# Altium schematic sheet [03]-28pins_sch.SchDoc (part 1 of 3)
size A2; DocumentNumber: 3; SheetNumber: 3; SheetTotal: 4
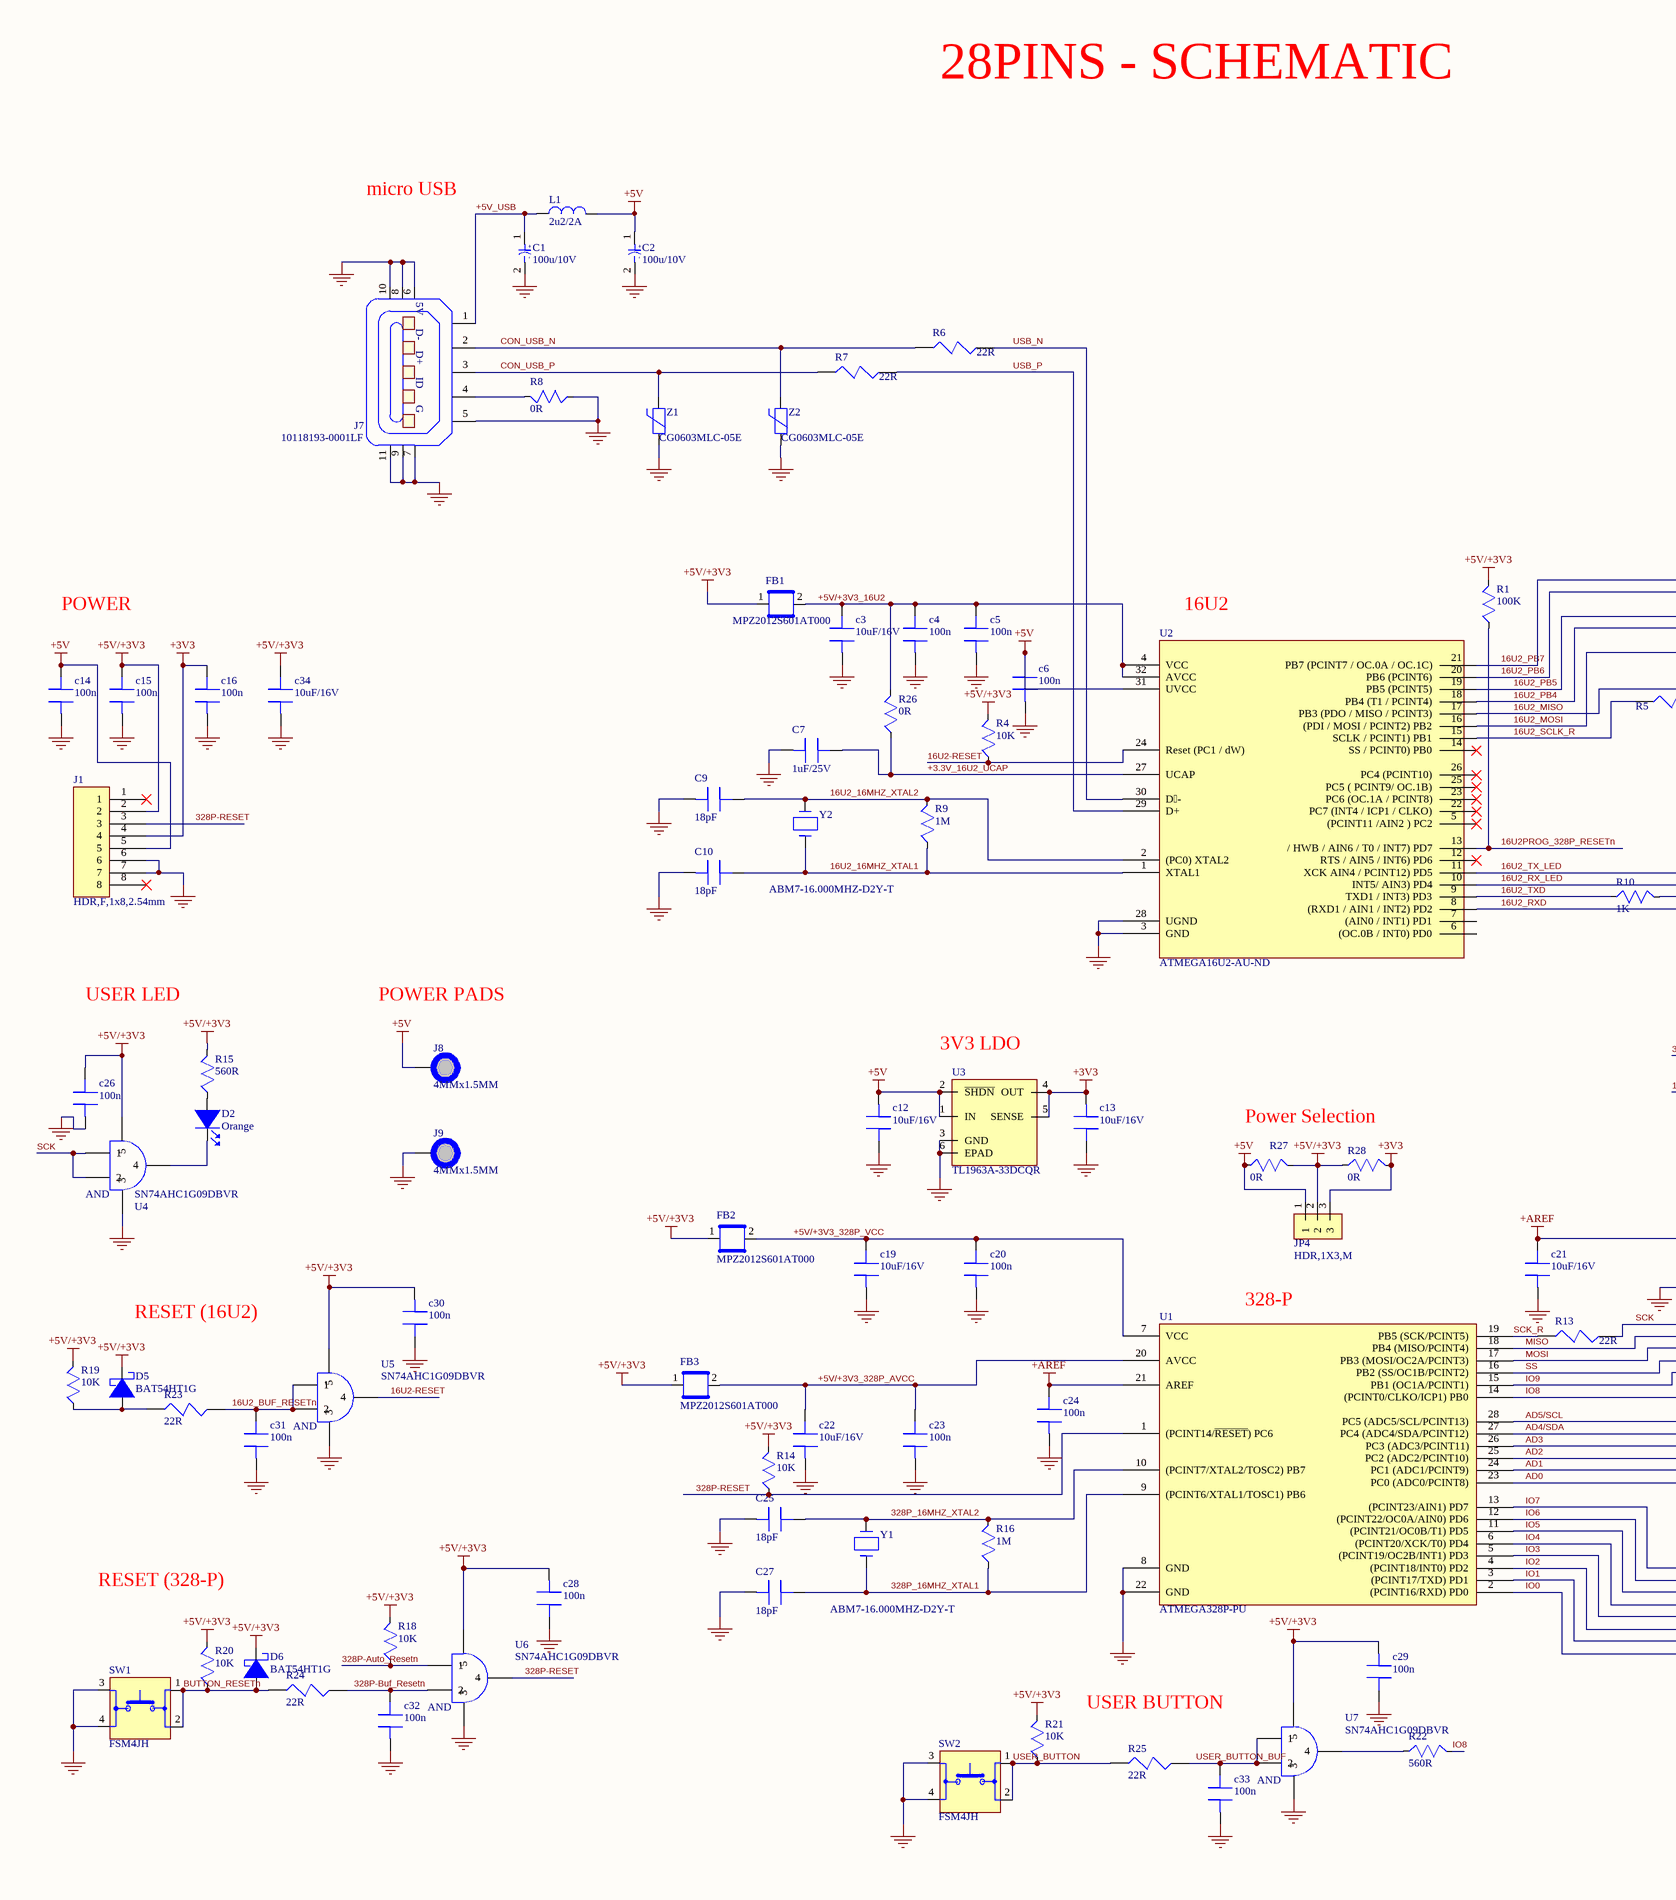
[diagram p0: [03]-28pins_sch.SchDoc, left]
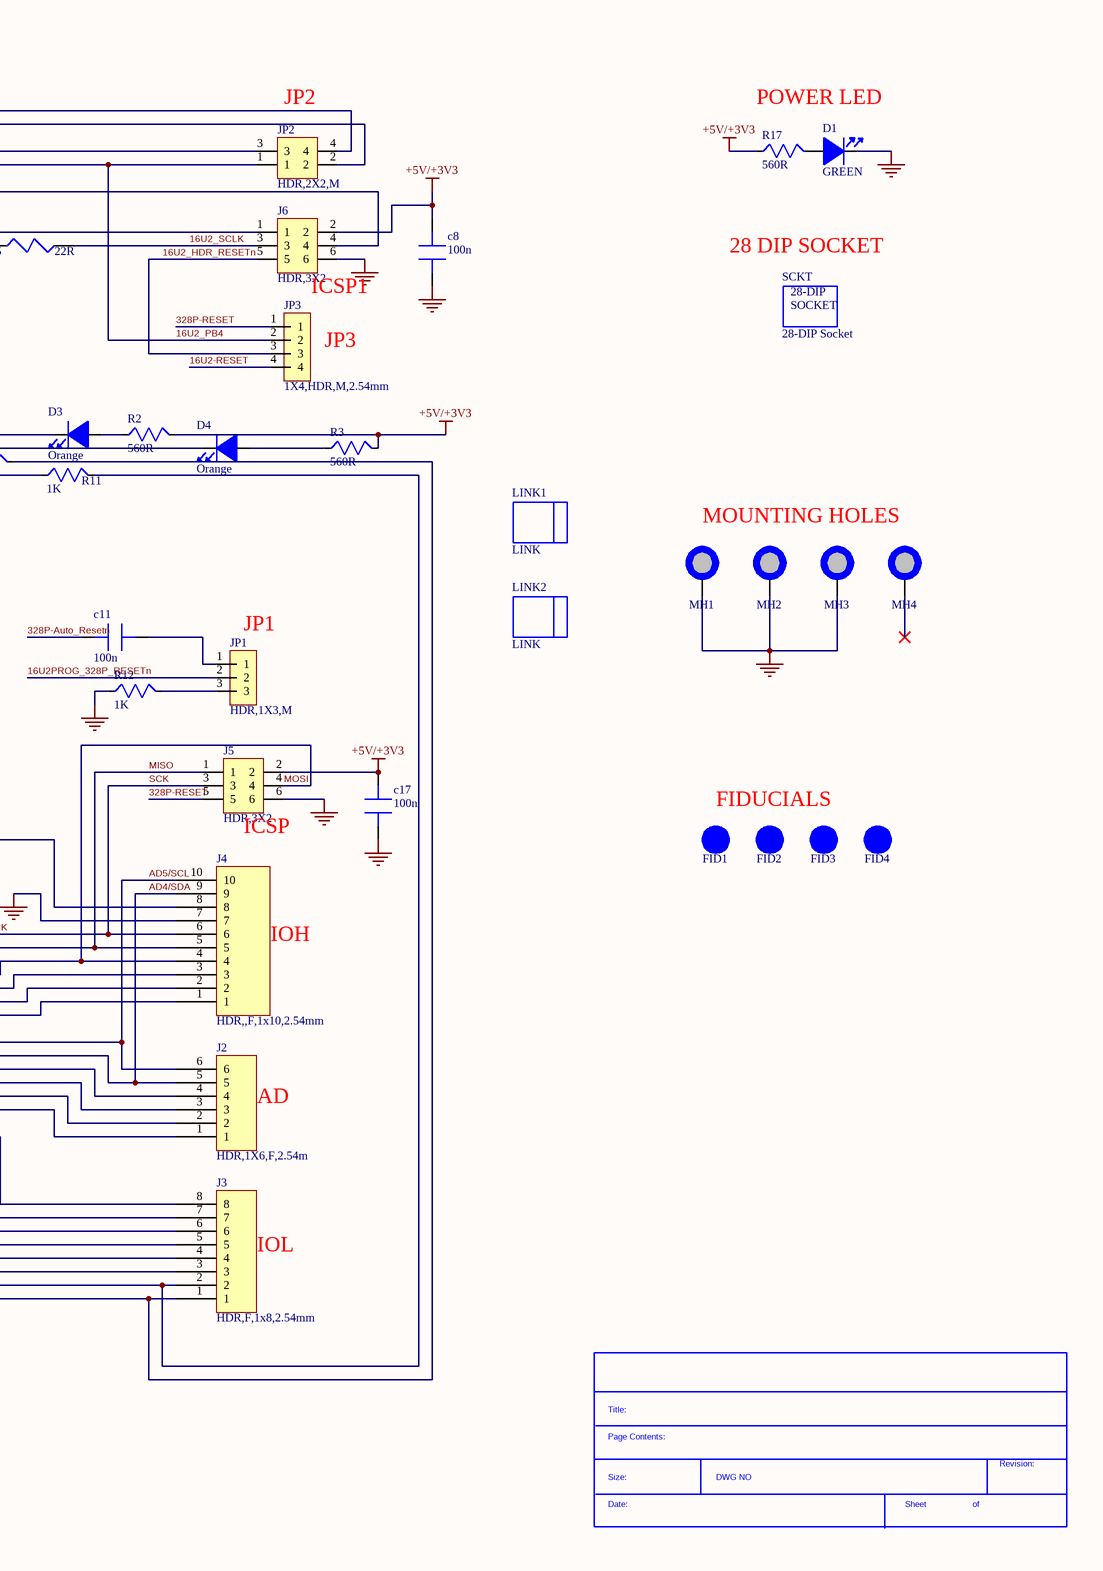
[diagram p1: [03]-28pins_sch.SchDoc, right]

## Parts
*?  SDTitleBlock  (value not drawn)  (graphical)
C1  100u/10V  [C_ALUM]
C2  100u/10V  [C_ALUM]
c3  10uF/16V  [X5R 0805]
c4  100n  [C0805]
c5  100n  [C0805]
c6  100n  [C0805]
C7  1uF/25V  [C0805]
c8  100n  [C0805]
C9  18pF  [C0805]
C10  18pF  [C0805]
c11  100n  [C0805]
c12  10uF/16V  [X5R 0805]
c13  10uF/16V  [X5R 0805]
c14  100n  [C0805]
c15  100n  [C0805]
c16  100n  [C0805]
c17  100n  [C0805]
c19  10uF/16V  [X5R 0805]
c20  100n  [C0805]
c21  10uF/16V  [X5R 0805]
c22  10uF/16V  [X5R 0805]
c23  100n  [C0805]
c24  100n  [C0805]
C25  18pF  [C0805]
c26  100n  [C0805]
C27  18pF  [C0805]
c28  100n  [C0805]
c29  100n  [C0805]
c30  100n  [C0805]
c31  100n  [C0805]
c32  100n  [C0805]
c33  100n  [C0805]
c34  10uF/16V  [X5R 0805]
D1  GREEN  [LED_0603]
D2  Orange  [LED_0603]
D3  Orange  [LED_0603]
D4  Orange  [LED_0603]
D5  BAT54HT1G  [SOD323]
D6  BAT54HT1G  [SOD323]
FB1  MPZ2012S601AT000  [C0805]
FB2  MPZ2012S601AT000  [C0805]
FB3  MPZ2012S601AT000  [C0805]
FID1  1MMC  [FID _40x120D]  (value not drawn)  (no BOM)
FID2  1MMC  [FID _40x120D]  (value not drawn)  (no BOM)
FID3  1MMC  [FID _40x120D]  (value not drawn)  (no BOM)
FID4  1MMC  [FID _40x120D]  (value not drawn)  (no BOM)
J1  HDR,F,1x8,2.54mm  [HDR,F,1X8,2.54mm]
J2  HDR,1X6,F,2.54m  [HDR,1X6,F,2.54mm]
J3  HDR,F,1x8,2.54mm  [HDR,F,1X8,2.54mm]
J4  HDR,,F,1x10,2.54mm  [HDR,F,1x10,2.54mm]
J5  HDR,3X2  [HDR,2X3,2.54mm]
J6  HDR,3X2  [HDR,2X3,2.54mm]
J7  10118193-0001LF  [10118193]
J8  4MMx1.5MM  [pad_with_holes_4MMx1.5MM]  (no BOM)
J9  4MMx1.5MM  [pad_with_holes_4MMx1.5MM]  (no BOM)
JP1  HDR,1X3,M  [HDR,1X3,M,2.54mm]
JP2  HDR,2X2,M  [HDR,2X2,2.54mm]
JP3  1X4,HDR,M,2.54mm  [HDR,1X4,M,2.54mm]
JP4  HDR,1X3,M  [HDR,1X3,M,2.54mm]
L1  2u2/2A  [INDUCTOR]
LINK1  LINK  (mechanical)
LINK2  LINK  (mechanical)
MH1  MH_7.4MM,drill  [MH_7.4MM]  (value not drawn)  (no BOM)
MH2  MH_7.4MM,drill  [MH_7.4MM]  (value not drawn)  (no BOM)
MH3  MH_7.4MM,drill  [MH_7.4MM]  (value not drawn)  (no BOM)
MH4  MH_7.4_noncoppper_nonplated  [MH7.44_nonplated_nonecopper]  (value not drawn)
R1  100K  [R0805]
R2  560R  [R0805]
R3  560R  [R0805]
R4  10K  [R0805]
R5  22R  [R0805]
R6  22R  [R0805]
R7  22R  [R0805]
R8  0R  [R0805]
R9  1M  [R0805]
R10  1K  [R0805]
R11  1K  [R0805]
R12  1K  [R0805]
R13  22R  [R0805]
R14  10K  [R0805]
R15  560R  [R0805]
R16  1M  [R0805]
R17  560R  [R0805]
R18  10K  [R0805]
R19  10K  [R0805]
R20  10K  [R0805]
R21  10K  [R0805]
R22  560R  [R0805]
R23  22R  [R0805]
R24  22R  [R0805]
R25  22R  [R0805]
R26  0R  [R0805]
R27  0R  [R0805]
R28  0R  [R0805]
SCKT  28-DIP Socket  [28 sckt_DIP]
SW1  FSM4JH  [SW]
SW2  FSM4JH  [SW]
U1  ATMEGA328P-PU  [28_DIP_7.62mm]
U2  ATMEGA16U2-AU-ND  [TQFP32]
U3  TL1963A-33DCQR  [DCQ(R-PDSO-G6)]
U4  SN74AHC1G09DBVR  [DBV_SOT]
U5  SN74AHC1G09DBVR  [DBV_SOT]
U6  SN74AHC1G09DBVR  [DBV_SOT]
U7  SN74AHC1G09DBVR  [DBV_SOT]
Y1  ABM7-16.000MHZ-D2Y-T  [ABM7-16MHz,BIG]
Y2  ABM7-16.000MHZ-D2Y-T  [ABM7-16MHz,BIG]
Z1  CG0603MLC-05E  [R0603]
Z2  CG0603MLC-05E  [R0603]

## Nets
+3V3: c13.1 c16.2 J1.4 JP4.3 R28.2 U3.4(OUT) U3.5(SENSE)
+5V: C2.1 c6.2 c12.1 c14.2 J1.5 J8.1 JP4.1 L1.2 R27.1 U2.31(UVCC) U3.1(IN) U3.2(~{SHDN})
+5V/+3V3: c8.2 c15.2 c17.2 c26.2 c28.1 c29.1 c30.1 c34.2 D5.1(Cathode) D6.1(Cathode) FB1.1 FB2.1 FB3.1 J1.2 J5.2 J6.2 JP4.2 R1.2 R2.2 R3.2 R4.2 R14.2 R15.2 R17.1 R18.2 R19.2 R20.2 R21.2 R27.2 R28.1 U4.5 U5.5 U6.5 U7.5
+AREF: c21.2 c24.2 J4.8 U1.21(AREF)
GND: C1.2 C2.2 c3.1 c4.1 c5.1 c6.1 C7.1 c8.1 C9.1 C10.1 c12.2 c13.2 c14.1 c15.1 c16.1 c17.1 c19.1 c20.1 c21.1 c22.1 c23.1 c24.1 C25.1 c26.1 C27.1 c28.2 c29.2 c30.2 c31.1 c32.1 c33.1 c34.1 D1.1(Cathode) J1.6 J1.7 J4.7 J5.6 J6.6 J7.5 J7.6 J7.7 J7.8 J7.9 J7.10 J7.11 J9.1 MH1.1 MH2.1 MH3.1 R8.1 R12.1 SW1.3 SW1.4 SW2.3 SW2.4 U1.8(GND) U1.22(GND) U2.3(GND) U2.28(UGND) U3.3(GND) U3.6(EPAD) U4.3 U5.3 U6.3 U7.3 Z1.1 Z2.1
16U2-RESET: JP3.4 R4.1 U2.24(Reset_(PC1_/_dW)) U5.4
16U2_16MHZ_XTAL1: C10.2 R9.1 U2.1(XTAL1) Y2.1
16U2_16MHZ_XTAL2: C9.2 R9.2 U2.2((PC0)_XTAL2) Y2.2
16U2_BUF_RESETn: c31.2 R23.2 U5.1 U5.2
16U2_HDR_RESETn: J6.5 JP3.3
16U2_MISO: J6.1 U2.17(PB3_(PDO_/_MISO_/_PCINT3))
16U2_MOSI: J6.4 U2.16((PDI_/_MOSI_/_PCINT2)_PB2)
16U2_PB4: JP2.1 JP3.2 U2.18(PB4_(T1_/_PCINT4))
16U2_PB5: JP2.3 U2.19(PB5_(PCINT5))
16U2_PB6: JP2.2 U2.20(PB6_(PCINT6))
16U2_PB7: JP2.4 U2.21(PB7_(PCINT7_/_OC.0A_/_OC.1C))
16U2_RX_LED: D4.1(Cathode) U2.10(INT5/_AIN3)_PD4)
16U2_RXD: R11.1 U2.8((RXD1_/_AIN1_/_INT2)_PD2)
16U2_SCLK: J6.3 R5.2
16U2_SCLK_R: R5.1 U2.15(SCLK_/_PCINT1)_PB1)
16U2_TX_LED: D3.1(Cathode) U2.11(XCK_AIN4_/_PCINT12)_PD5)
16U2_TXD: R10.1 U2.9(TXD1_/_INT3)_PD3)
16U2PROG_328P_RESETn: JP1.2 R1.1 U2.13(/_HWB_/_AIN6_/_T0_/_INT7)_PD7)
328P-Auto_Resetn: c11.1 R18.1 U6.1
328P-Buf_Resetn: c32.2 R24.2 U6.2
328P-RESET: J1.3 J5.5 JP3.1 R14.1 U1.1((PCINT14/~{RESET})_PC6) U6.4
328P_16MHZ_XTAL1: C27.2 R16.1 U1.9((PCINT6/XTAL1/TOSC1)_PB6) Y1.1
328P_16MHZ_XTAL2: C25.2 R16.2 U1.10((PCINT7/XTAL2/TOSC2)_PB7) Y1.2
+3.3V_16U2_UCAP: C7.2 R26.1 U2.27(UCAP)
+5V/+3V3_16U2: c3.2 c4.2 c5.2 FB1.2 R26.2 U2.4(VCC) U2.32(AVCC)
+5V/+3V3_328P_AVCC: c22.2 c23.2 FB3.2 U1.20(AVCC)
+5V/+3V3_328P_VCC: c19.2 c20.2 FB2.2 U1.7(VCC)
+5V_USB: C1.1 J7.1 L1.1
AD0: J2.1 U1.23(PC0_(ADC0/PCINT8))
AD1: J2.2 U1.24(PC1_(ADC1/PCINT9))
AD2: J2.3 U1.25(PC2_(ADC2/PCINT10))
AD3: J2.4 U1.26(PC3_(ADC3/PCINT11))
AD4/SDA: J2.5 J4.9 U1.27(PC4_(ADC4/SDA/PCINT12))
AD5/SCL: J2.6 J4.10 U1.28(PC5_(ADC5/SCL/PCINT13))
BUTTON_RESETn: D6.2(Anode) R20.1 R24.1 SW1.1 SW1.2
CON_USB_N: J7.2 R6.1 Z2.2
CON_USB_P: J7.3 R7.1 Z1.2
IO0: J3.1 R10.2 U1.2((PCINT16/RXD)_PD0)
IO1: J3.2 R11.2 U1.3((PCINT17/TXD)_PD1)
IO2: J3.3 U1.4((PCINT18/INT0)_PD2)
IO3: J3.4 U1.5((PCINT19/OC2B/INT1)_PD3)
IO4: J3.5 U1.6((PCINT20/XCK/T0)_PD4)
IO5: J3.6 U1.11((PCINT21/OC0B/T1)_PD5)
IO6: J3.7 U1.12((PCINT22/OC0A/AIN0)_PD6)
IO7: J3.8 U1.13((PCINT23/AIN1)_PD7)
IO8: J4.1 R22.2 U1.14((PCINT0/CLKO/ICP1)_PB0)
IO9: J4.2 U1.15(PB1_(OC1A/PCINT1))
MISO: J4.5 J5.1 U1.18(PB4_(MISO/PCINT4))
MOSI: J4.4 J5.4 U1.17(PB3_(MOSI/OC2A/PCINT3))
SCK: J4.6 J5.3 R13.2 U4.1 U4.2
SCK_R: R13.1 U1.19(PB5_(SCK/PCINT5))
SS: J4.3 U1.16(PB2_(SS/OC1B/PCINT2))
USB_N: R6.2 U2.30(D-)
USB_P: R7.2 U2.29(D+)
USER_BUTTON: R21.1 R25.1 SW2.1 SW2.2
USER_BUTTON_BUF: c33.2 R25.2 U7.1 U7.2
Netc11_2: c11.2 JP1.1
NetD1_2: D1.2(Anode) R17.2
NetD2_1: D2.1(Cathode) U4.4
NetD2_2: D2.2(Anode) R15.1
NetD3_2: D3.2(Anode) R2.1
NetD4_2: D4.2(Anode) R3.1
NetD5_2: D5.2(Anode) R19.1 R23.1
NetJ7_4: J7.4 R8.2
NetJP1_3: JP1.3 R12.2
NetR22_1: R22.1 U7.4

Not connected (* = marked no-connect by the designer): J1 1* 8*; MH4 1*; U2 5((PCINT11_/AIN2_)_PC2)* 6((OC.0B_/_INT0)_PD0) 7((AIN0_/_INT1)_PD1) 12(RTS_/_AIN5_/_INT6)_PD6)* 14(SS_/_PCINT0)_PB0)* 22(PC7_(INT4_/_ICP1_/_CLKO))* 23(PC6_(OC.1A_/_PCINT8))* 25(PC5_(_PCINT9/_OC.1B))* 26(PC4_(PCINT10))*

## Notes on the sheet
- 28PINS - SCHEMATIC
- micro USB
- (near JP2) JP2
- POWER LED
- POWER
- 16U2
- (near J6) ICSP1
- (near SCKT) 28 DIP SOCKET
- (near JP3) JP3
- USER LED
- POWER PADS
- MOUNTING HOLES
- (near U3) 3V3 LDO
- (near JP1) JP1
- Power Selection
- (near J5) ICSP
- FIDUCIALS
- (near U1) 328-P
- RESET (16U2)
- IOH
- (near J2) AD
- RESET (328-P)
- (near J3) IOL
- USER BUTTON
- (in symbol 4828-3004-CP) SOCKET
- (in symbol 10118193-0001LF) 5V; D-; D+; ID; G
- (in symbol EEE-1AA101WR) +; -
- (in symbol SDTitleBlock) Title:; Page Contents:; Revision:; Size:; DWG NO; Date:; Sheet; of
- (in symbol SN74AHC1G09DBVR) AND